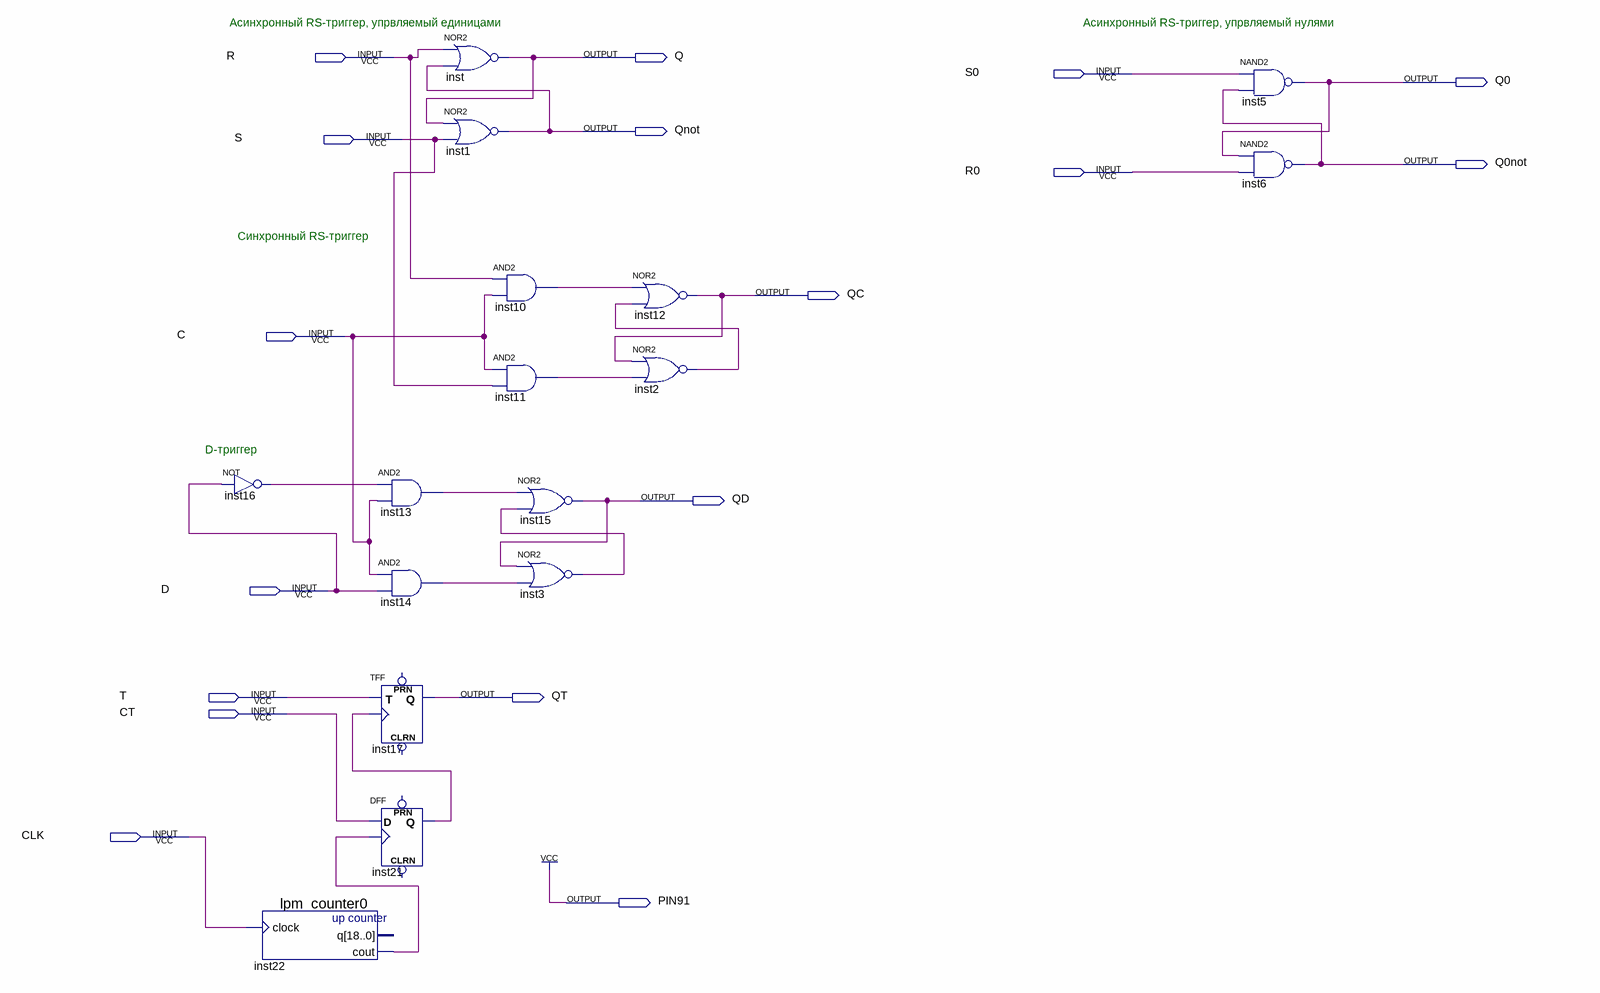
[diagram p0: schematic sheet]
// Quartus schematic Triggers.bdf as structural Verilog: 16 symbols, 17 pins
module Triggers (
  input  R,
  input  S0,
  input  S,
  input  R0,
  input  C,
  input  D,
  input  T,
  input  CT,
  input  CLK,
  output Q,
  output Q0,
  output Qnot,
  output Q0not,
  output QC,
  output QD,
  output QT,
  output PIN91
);

  wire inst2_out, inst3_out, inst10_out, inst11_out, inst13_out, inst14_out, inst16_out, inst21_q,
       inst22_cout;

  not inst16 (inst16_out, D);
  lpm_counter0 inst22 (.clock(CLK), .cout(inst22_cout));  // open: q
  and inst13 (inst13_out, inst16_out, C);
  and inst14 (inst14_out, C, D);
  TFF inst17 (.T(T), .CLK(inst21_q), .Q(QT));  // open: PRN, CLRN
  DFF inst21 (.CLK(inst22_cout), .D(CT), .Q(inst21_q));  // open: CLRN, PRN
  nor inst (Q, R, Qnot);
  nor inst1 (Qnot, Q, S);
  and inst10 (inst10_out, R, C);
  and inst11 (inst11_out, C, S);
  nor inst15 (QD, inst13_out, inst3_out);
  nor inst3 (inst3_out, QD, inst14_out);
  nor inst12 (QC, inst10_out, inst2_out);
  nor inst2 (inst2_out, QC, inst11_out);
  nand inst5 (Q0, S0, Q0not);
  nand inst6 (Q0not, Q0, R0);

  assign PIN91 = 1'b1;

  // Notes on the sheet:
  //   Асинхронный RS-триггер, упрвляемый единицами
  //   Асинхронный RS-триггер, упрвляемый нулями
  //   Синхронный RS-триггер
  //   D-триггер
endmodule
